# EAGLE design plunger-smt (EAGLE 5.06)
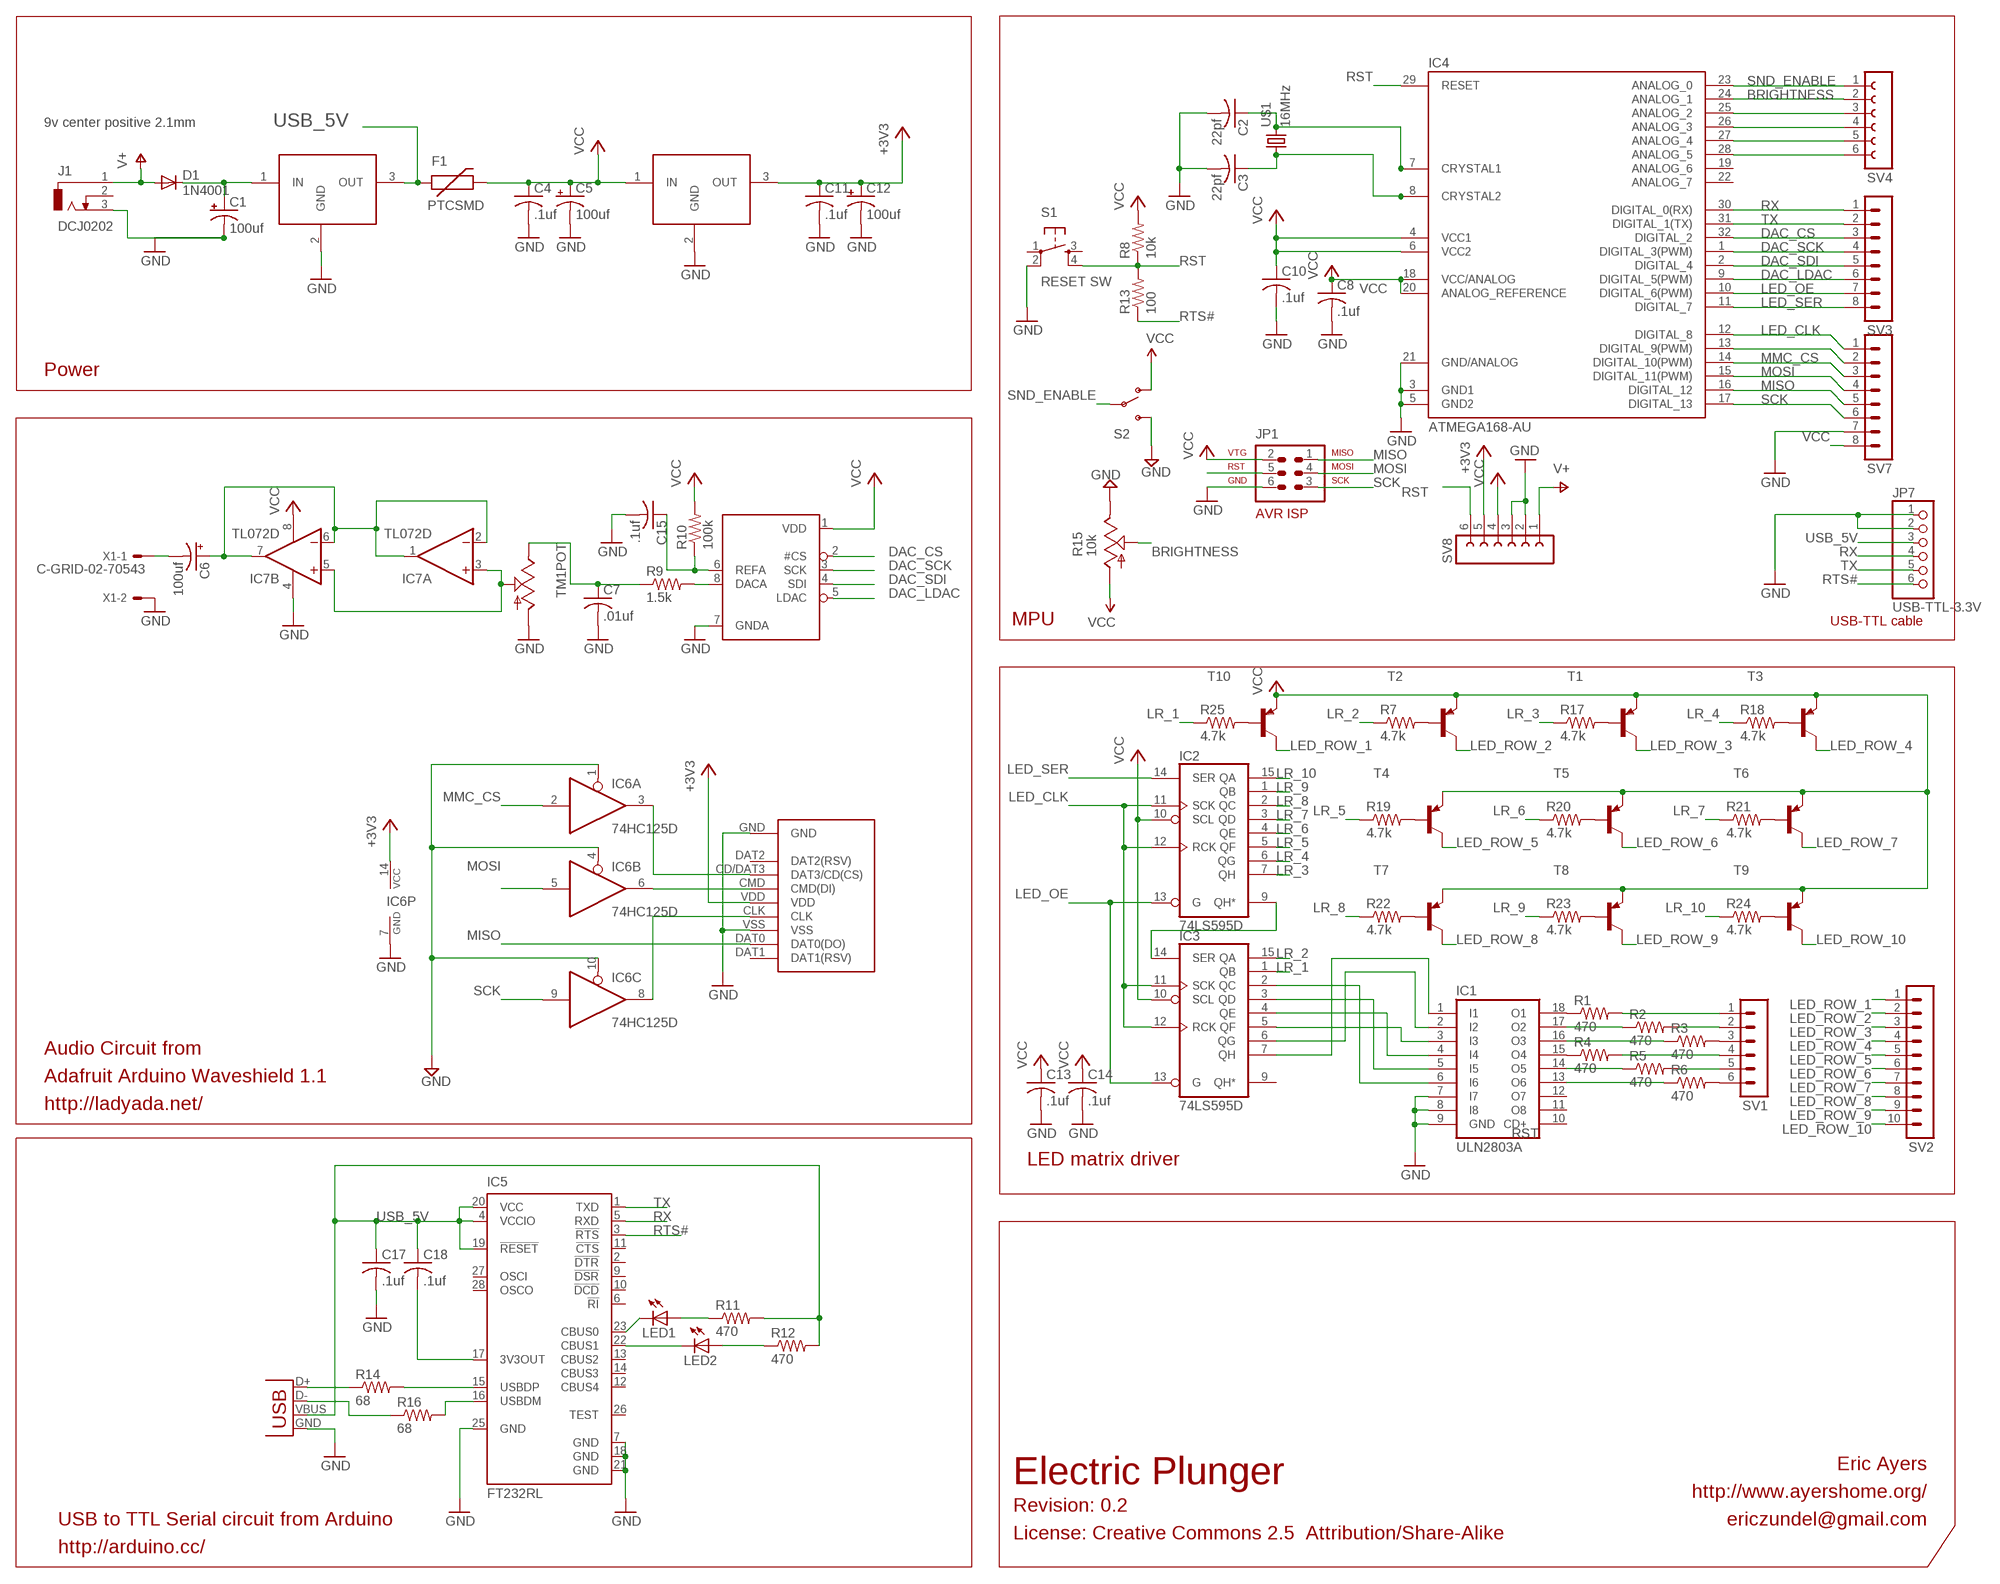
[diagram p0: schematic, sheet 1]

## Parts
C1  100uf  CPOL-USE  [PANASONIC_E]
C2  22pf  C-USC0805  [C0805]
C3  22pf  C-USC0805  [C0805]
C4  .1uf  C-USC0805  [C0805]
C5  100uf  CPOL-USE  [PANASONIC_E]
C6  100uf  CPOL-USD  [PANASONIC_D]
C7  .01uf  C-USC0805  [C0805]
C8  .1uf  C-USC0805  [C0805]
C10  .1uf  C-USC0805  [C0805]
C11  .1uf  C-USC0805  [C0805]
C12  100uf  CPOL-USE  [PANASONIC_E]
C13  .1uf  C-USC0805  [C0805]
C14  .1uf  C-USC0805  [C0805]
C15  .1uf  C-USC0805  [C0805]
C17  .1uf  C-USC0805  [C0805]
C18  .1uf  C-USC0805  [C0805]
D1  1N4001  DIODEPTH  [DIODE-1N4001]
F1  PTCSMD  [PTC-1206]
IC1  ULN2803A  ULN2803AULN2803ADW  [SO18W]
IC2  74LS595D  [SO16]
IC3  74LS595D  [SO16]
IC4  ATMEGA168-AU  [TQFP32-08]
IC5  FT232RL  [SSOP28]
IC6  74HC125D  [SO14]
IC7  TL072D  [SO08]
J1  DCJ0202  [DCJ0202]
JP1  AVR-ISP-6  [AVR-ISP-6]
JP7  USB-TTL-3.3V  PINHD-1X6CLEAN  [1X06-CLEAN]
LED1  LEDCHIPLED_0805  [CHIPLED_0805]
LED2  LEDCHIPLED_0805  [CHIPLED_0805]
R1  470  R-US_R0805  [R0805]
R2  470  R-US_R0805  [R0805]
R3  470  R-US_R0805  [R0805]
R4  470  R-US_R0805  [R0805]
R5  470  R-US_R0805  [R0805]
R6  470  R-US_R0805  [R0805]
R7  4.7k  R-US_R0805  [R0805]
R8  10k  R-US_R0805  [R0805]
R9  1.5k  R-US_R0805  [R0805]
R10  100k  R-US_R0805  [R0805]
R11  470  R-US_R0805  [R0805]
R12  470  R-US_R0805  [R0805]
R13  100  R-US_R0805  [R0805]
R14  68  R-US_R0805  [R0805]
R15  10k  TRIM_US-S63S  [S63S]
R16  68  R-US_R0805  [R0805]
R17  4.7k  R-US_R0805  [R0805]
R18  4.7k  R-US_R0805  [R0805]
R19  4.7k  R-US_R0805  [R0805]
R20  4.7k  R-US_R0805  [R0805]
R21  4.7k  R-US_R0805  [R0805]
R22  4.7k  R-US_R0805  [R0805]
R23  4.7k  R-US_R0805  [R0805]
R24  4.7k  R-US_R0805  [R0805]
R25  4.7k  R-US_R0805  [R0805]
REG3.3  KFBDT  [DPACK]
REG5.5  KFBDT  [DPACK]
S1  RESET SW  TAC_SWITCHPTH  [TACTILE-PTH]
S2  SWITCH-SPSTPTH  [SWITCH-SPDT]
SV1  MA06-1  [MA06-1]
SV2  MA10-1  [MA10-1]
SV3  MA08-1  [MA08-1]
SV4  FE06-1  [FE06]
SV7  MA08-1  [MA08-1]
SV8  FE06-1  [FE06]
T1  BC807-16-PNP-SOT23-BEC  [SOT23-BEC]
T2  BC807-16-PNP-SOT23-BEC  [SOT23-BEC]
T3  BC807-16-PNP-SOT23-BEC  [SOT23-BEC]
T4  BC807-16-PNP-SOT23-BEC  [SOT23-BEC]
T5  BC807-16-PNP-SOT23-BEC  [SOT23-BEC]
T6  BC807-16-PNP-SOT23-BEC  [SOT23-BEC]
T7  BC807-16-PNP-SOT23-BEC  [SOT23-BEC]
T8  BC807-16-PNP-SOT23-BEC  [SOT23-BEC]
T9  BC807-16-PNP-SOT23-BEC  [SOT23-BEC]
T10  BC807-16-PNP-SOT23-BEC  [SOT23-BEC]
TM1  THUMBPOT  [THUMBWHEEL]
U$1  16MHz  CRYTALTC26H  [TC26H]
U$2  MCP4921  [SO8]
U$3  HIROSE-MICRO-SD-DM3C-SF  [HIROSE-SD-MICRO]
X1  C-GRID-02-70543  [70543-02]
X2  USBPTH  [USB-B-PTH]

## Nets
+3V3: C11.1 C12.+ IC6.14(P:VCC) REG3.3.3(OUT) SV8.5 U$3.VDD
BRIGHTNESS: IC4.24(ANALOG_1) R15.S SV4.2
DAC_CS: IC4.32(DIGITAL_2) SV3.3 U$2.2(#CS)
DAC_LDAC: IC4.9(DIGITAL_5(PWM)) SV3.6 U$2.5(LDAC)
DAC_SCK: IC4.1(DIGITAL_3(PWM)) SV3.4 U$2.3(SCK)
DAC_SDI: IC4.2(DIGITAL_4) SV3.5 U$2.4(SDI)
GND: C1.- C2.2 C3.2 C4.2 C5.- C7.2 C8.2 C10.2 C11.2 C12.- C13.2 C14.2 C15.2 C17.2 IC1.7(I7) IC1.8(I8) IC1.9(GND) IC4.3(GND1) IC4.5(GND2) IC4.21(GND/ANALOG) IC5.7(GND) IC5.18(GND) IC5.21(GND) IC5.25(GND) IC6.1(A:OE) IC6.4(B:OE) IC6.7(P:GND) IC6.10(C:OE) IC7.4(P:V-) J1.3 JP1.6 JP7.1 JP7.2 R15.E REG3.3.2(GND) REG5.5.2(GND) S1.2 S2.3(S) SV7.7 SV8.2 SV8.3 TM1.1(POT:A) U$2.7(GNDA) U$3.GND U$3.VSS X1.2 X2.GND
LED_CLK: IC2.11(SCK) IC2.12(RCK) IC3.11(SCK) IC3.12(RCK) IC4.12(DIGITAL_8) SV7.1
LED_COL_1: R1.2 SV1.1
LED_COL_3: R3.2 SV1.3
LED_COL_4: R4.2 SV1.4
LED_COL_5: R5.2 SV1.5
LED_COL_6: R6.2 SV1.6
LED_OE: IC2.13(G) IC3.13(G) IC4.10(DIGITAL_6(PWM)) SV3.7
LED_ROW_1: SV2.1 T10.C
LED_ROW_2: SV2.2 T2.C
LED_ROW_3: SV2.3 T1.C
LED_ROW_4: SV2.4 T3.C
LED_ROW_5: SV2.5 T4.C
LED_ROW_6: SV2.6 T5.C
LED_ROW_7: SV2.7 T6.C
LED_ROW_8: SV2.8 T7.C
LED_ROW_9: SV2.9 T8.C
LED_ROW_10: SV2.10 T9.C
LED_SER: IC2.14(SER) IC4.11(DIGITAL_7) SV3.8
LR_1: IC3.1(QB) R25.1
LR_2: IC3.15(QA) R7.1
LR_3: IC2.7(QH) R17.1
LR_4: IC2.6(QG) R18.1
LR_5: IC2.5(QF) R19.1
LR_6: IC2.4(QE) R20.1
LR_7: IC2.3(QD) R21.1
LR_8: IC2.2(QC) R22.1
LR_9: IC2.1(QB) R23.1
LR_10: IC2.15(QA) R24.1
MISO: IC4.16(DIGITAL_12) JP1.1 SV7.5 U$3.DAT0(DAT0(DO))
MMC_CS: IC4.14(DIGITAL_10(PWM)) IC6.2(A:I) SV7.3
MOSI: IC4.15(DIGITAL_11(PWM)) IC6.5(B:I) JP1.4 SV7.4
N$2: IC1.6(I6) IC3.2(QC)
N$3: IC1.5(I5) IC3.3(QD)
N$4: IC1.4(I4) IC3.4(QE)
N$5: IC1.3(I3) IC3.5(QF)
N$6: IC1.2(I2) IC3.6(QG)
N$8: R2.2 SV1.2
N$10: IC1.13(O6) R6.1
N$11: IC1.18(O1) R1.1
N$12: IC1.16(O3) R3.1
N$13: IC1.14(O5) R5.1
N$14: IC1.1(I1) IC3.7(QH)
N$18: IC1.15(O4) R4.1
N$20: IC1.17(O2) R2.1
N$21: R7.2 T2.B
N$23: IC2.9(QH*) IC3.14(SER)
N$24: C2.1 IC4.7(CRYSTAL1) U$1.2
N$25: C3.1 IC4.8(CRYSTAL2) U$1.1
N$26: IC4.13(DIGITAL_9(PWM)) SV7.2
N$28: C15.1 R10.1 U$2.6(REFA)
N$29: IC5.16(USBDM) R16.2
N$30: R17.2 T1.B
N$34: C1.+ D1.C REG5.5.1(IN)
N$35: IC6.6(B:O) U$3.CMD(CMD(DI))
N$36: IC6.3(A:O) U$3.CD/DAT3(DAT3/CD(CS))
N$37: C6.+ IC7.1(A:OUT) IC7.2(A:-IN) IC7.6(B:-IN) IC7.7(B:OUT)
N$38: IC7.3(A:+IN) IC7.5(B:+IN) TM1.2(POT:S)
N$39: C6.- X1.1
N$40: IC4.25(ANALOG_2) SV4.3
N$41: IC6.8(C:O) U$3.CLK
N$42: C7.1 R9.1 TM1.3(POT:E)
N$43: IC4.26(ANALOG_3) SV4.4
N$44: IC4.27(ANALOG_4) SV4.5
N$45: R14.1 X2.D+
N$46: IC4.28(ANALOG_5) SV4.6
N$47: R18.2 T3.B
N$48: R19.2 T4.B
N$49: IC5.15(USBDP) R14.2
N$50: C18.2 IC5.17(3V3OUT)
N$51: IC5.23(CBUS0) LED1.C
N$52: IC5.22(CBUS1) LED2.C
N$53: LED1.A R11.1
N$54: LED2.A R12.1
N$55: R16.1 X2.D-
N$56: R9.2 U$2.8(DACA)
N$57: R20.2 T5.B
N$58: R21.2 T6.B
N$59: R22.2 T7.B
N$60: R23.2 T8.B
N$61: R24.2 T9.B
N$62: R25.2 T10.B
RST: IC4.29(RESET) JP1.5 R8.1 R13.2 S1.4 SV8.6
RTS#: IC5.3(!RTS) JP7.6 R13.1
RX: IC4.30(DIGITAL_0(RX)) IC5.5(RXD) JP7.4 SV3.1
SCK: IC4.17(DIGITAL_13) IC6.9(C:I) JP1.3 SV7.6
SND_ENABLE: IC4.23(ANALOG_0) S2.2(P) SV4.1
TX: IC4.31(DIGITAL_1(TX)) IC5.1(TXD) JP7.5 SV3.2
USB_5V: C17.1 C18.1 F1.1 IC5.4(VCCIO) IC5.19(!RESET) IC5.20(VCC) JP7.3 R11.2 R12.2 REG5.5.3(OUT) X2.VBUS
V+: D1.A J1.1 SV8.1
VCC: C4.1 C5.+ C8.1 C10.1 C13.1 C14.1 F1.2 IC2.10(SCL) IC3.10(SCL) IC4.4(VCC1) IC4.6(VCC2) IC4.18(VCC/ANALOG) IC4.20(ANALOG_REFERENCE) IC7.8(P:V+) JP1.2 R8.2 R10.2 R15.A REG3.3.1(IN) S2.1(O) SV7.8 SV8.4 T1.E T2.E T3.E T4.E T5.E T6.E T7.E T8.E T9.E T10.E U$2.1(VDD)
Unconnected: IC1.10(CD+) IC1.11(O8) IC1.12(O7) IC3.9(QH*) IC4.19(ANALOG_6) IC4.22(ANALOG_7) IC5.2(!DTR) IC5.6(!RI) IC5.9(!DSR) IC5.10(!DCD) IC5.11(!CTS) IC5.12(CBUS4) IC5.13(CBUS2) IC5.14(CBUS3) IC5.26(TEST) IC5.27(OSCI) IC5.28(OSCO) IC6.11(D:O) IC6.12(D:I) IC6.13(D:OE) J1.2 S1.1 S1.3 TM1.SW1(SW:S) TM1.SW2(SW:P) U$3.DAT1(DAT1(RSV)) U$3.DAT2(DAT2(RSV))

## Notes on the sheet
- 9v center positive 2.1mm
- Power
- MPU | USB-TTL cable
- Audio Circuit from
- Adafruit Arduino Waveshield 1.1
- http://ladyada.net/
- LED matrix driver
- Eric Ayers
- Electric Plunger
- http://www.ayershome.org/
- Revision: 0.2
- USB to TTL Serial circuit from Arduino | ericzundel@gmail.com
- License: Creative Commons 2.5  Attribution/Share-Alike
- http://arduino.cc/

## Power pins joined to a net without a drawn wire
GND: IC2.8(GND) IC3.8(GND)
VCC: IC2.16(VCC) IC3.16(VCC)

## Library data of the parts
C1 C5 C6 C12 = resistor:CPOL-US: POLARIZED CAPACITOR, American symbol
C2 C3 C7 C8 C10 C13-C15 C17 C18 = rcl:C-US: CAPACITOR, American symbol
C4 C11 = resistor:C-US: CAPACITOR, American symbol
D1 = SparkFun:DIODE: Diode These are standard reverse protection diodes and small signal diodes. SMA package can handle up to about 1A. SOD-323 can handle about 200mA. What the SOD-323 package when ordering, there are some mfgs out there that are 5-pin packages.
F1 = SparkFun:PTC: Resettable Fuse PTC Resettable Fuse. Spark Fun Electronics SKU : COM-08357
IC1 = uln-udn:ULN2803A: DRIVER ARRAY
IC2 IC3 = 74xx-us:74*595: 8-bit SHIFT REGISTER, output latch
IC4 = Arduino-AVR:ATMEGA168
IC5 = ftdichip:FT232R: Source: http://www.ftdichip.com/Documents/DataSheets/DS_FT232R_v104.pdf
IC6 = 74xx-eu:74*125: Quad bus BUFFER, 3-state
IC7 = linear:TL072: OP AMP
J1 = con-jack:DCJ0202: DC POWER JACK Source: DCJ0202.pdf
JP1 = avr-5-4.16:AVR-ISP-6: AVR ISP-6 Serial Programming Header
JP7 = carduino:PINHD-1X6: PIN HEADER
LED1 LED2 = led:LED: LED OSRAM: - CHIPLED LG R971, LG N971, LY N971, LG Q971, LY Q971, LO R971, LY R971 LH N974, LH R974 LS Q976, LO Q976, LY Q976 LO Q996 - Hyper CHIPLED LW Q18S LB Q993, LB Q99A, LB R99A - SideLED LS A670, LO A670, LY A670, LG A670, LP A670 LB A673, LV A673, LT A673, LW A673 LH A674 LY A675 LS A676, LA A676, LO A676, LY A676, LW A676 LS A679, LY A679, LG A679 - Hyper Micro SIDELED® LS Y876, LA Y876, LO Y876, LY Y876 LT Y87S - SmartLED LW L88C, LW L88S LB L89C, LB L89S, LG L890 LS L89K, LO L89K, LY L89K LS L896, LA L896, LO L896, LY L896 - TOPLED LS T670, LO T670, LY T670, LG T670, LP T670 LSG T670, LSP T670, LSY T670, LOP T670, LYG T670 LG T671, LOG T671, LSG T671 LB T673, LV T673, LT T673, LW T673 LH T674 LS T676, LA T676, LO T676, LY T676, LB T676, LH T676, LSB T676, LW T676 LB T67C, LV T67C, LT T67C, LS T67K, LO T67K, LY T67K, LW E67C LS E67B, LA E67B, LO E67B, LY E67B, LB E67C, LV E67C, LT E67C LW T67C LS T679, LY T679, LG T679 LS T770, LO T770, LY T770, LG T770, LP T770 LB T773, LV T773, LT T773, LW T773 LH T774 LS E675, LA E675, LY E675, LS T675 LS T776, LA T776, LO T776, LY T776, LB T776 LHGB T686 LT T68C, LB T68C - Hyper Mini TOPLED® LB M676 - Mini TOPLED Santana® LG M470 LS M47K, LO M47K, LY M47K Source: http://www.osram.convergy.de LUXEON: - LUMILED® LXK2-PW12-R00, LXK2-PW12-S00, LXK2-PW14-U00, LXK2-PW14-V00 LXK2-PM12-R00, LXK2-PM12-S00, LXK2-PM14-U00 LXK2-PE12-Q00, LXK2-PE12-R00, LXK2-PE12-S00, LXK2-PE14-T00, LXK2-PE14-U00 LXK2-PB12-K00, LXK2-PB12-L00, LXK2-PB12-M00, LXK2-PB14-N00, LXK2-PB14-P00, LXK2-PB14-Q00 LXK2-PR12-L00, LXK2-PR12-M00, LXK2-PR14-Q00, LXK2-PR14-R00 LXK2-PD12-Q00, LXK2-PD12-R00, LXK2-PD12-S00 LXK2-PH12-R00, LXK2-PH12-S00 LXK2-PL12-P00, LXK2-PL12-Q00, LXK2-PL12-R00 Source: www.luxeon.com KINGBRIGHT: KA-3528ASYC Source: www.kingbright.com
R1-R7 R11 R12 R14 R16-R25 = resistor:R-US_: RESISTOR, American symbol
R8-R10 R13 = rcl:R-US_: RESISTOR, American symbol
R15 = pot:TRIM_US-: POTENTIOMETER
REG3.3 REG5.5 = eza-custom:KF*BDT: LDO Voltage Regulator
S1 = SparkFun:TAC_SWITCH: Momentary Switch Button commonly used for reset or general input. Spark Fun Electronics SKU : COM-00097
S2 = SparkFun:SWITCH-SPST: SPST Switch Simple slide switch. Spark Fun Electronics SKU : COM-00102
SV1 = con-lstb:MA06-1: PIN HEADER
SV2 = con-lstb:MA10-1: PIN HEADER
SV3 SV7 = con-lstb:MA08-1: PIN HEADER
SV4 SV8 = con-lsta:FE06-1: FEMALE HEADER
T1-T10 = transistor:*-PNP-: PNP Transistror
TM1 = ashield:THUMBPOT
U$1 = crystal:CRYTAL: CRYSTAL
U$2 = eza-custom:MCP4921
U$3 = eza-custom:HIROSE-MICRO-SD-DM3C-SF: Hirose micro sd push-pull surface mount, solder tab. dm3c-sf from mouser $2.02
X1 = con-molex:C-GRID-02: CONNECTOR wire to board 2.54 mm (0.100") pitch header
X2 = SparkFun:USB: USB Connectors USB-B-PTH is fully proven SKU : PRT-00139 USB-miniB is fully proven SKU : PRT-00587 USB-A-PCB is untested. USB-A-H is throughly reviewed, but untested. Spark Fun Electronics SKU : PRT-00437 USB-B-SMT is throughly reviewed, but untested. Needs silkscreen touching up. USB-A-S has not been used/tested USB-MB-H has not been used/tested

## Net classes
2 gnd: width 0.305 mm, drill 0.508 mm, clearance 0.152 mm
3 usbvcc: width 0.508 mm, drill 0.508 mm, clearance 0.152 mm

## Board
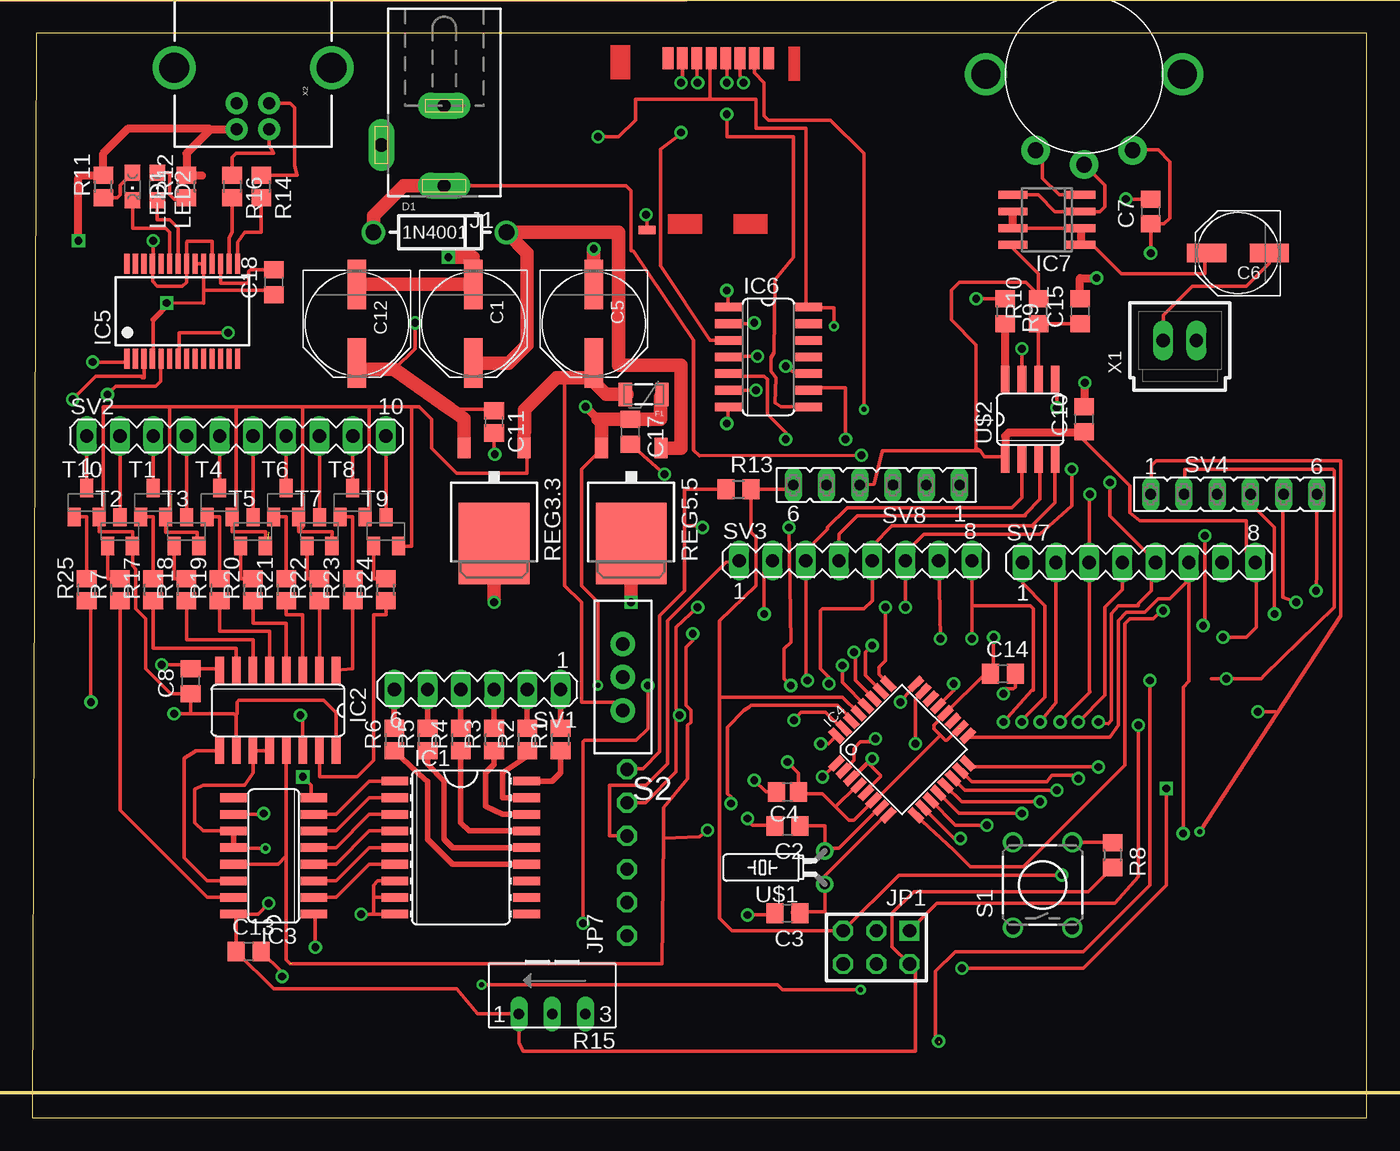
[diagram p1: board, top side]
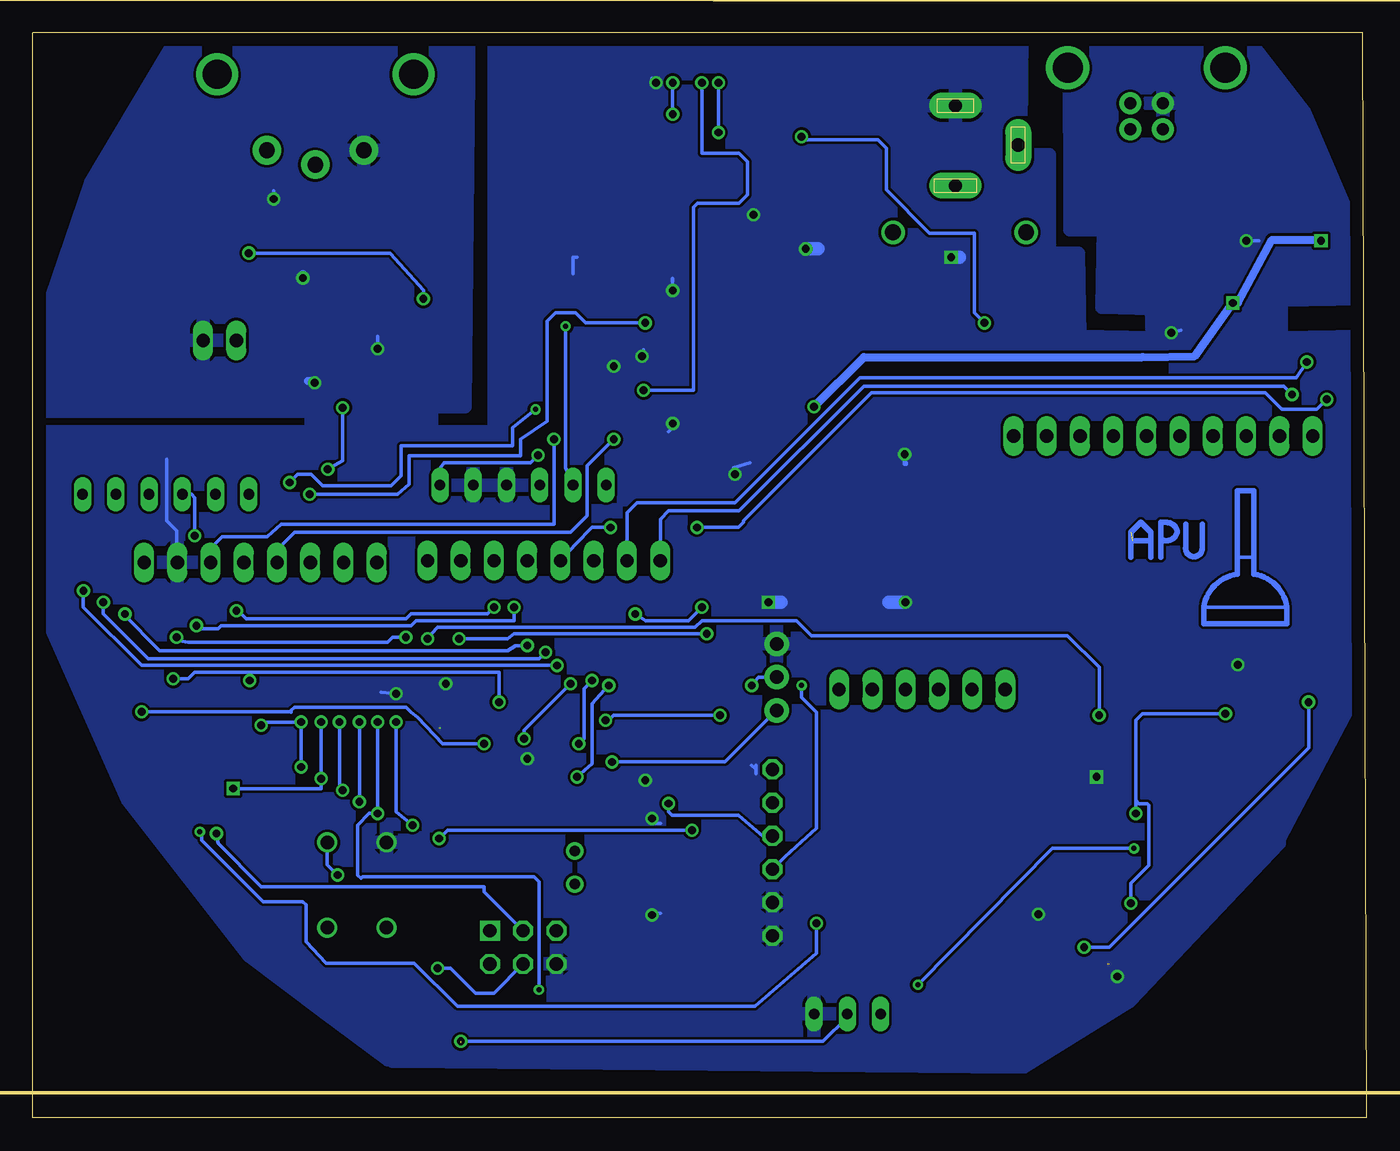
[diagram p2: board, bottom side, seen from below]

Size 101.92 x 82.87 mm. Coordinates in mm from the lower left corner, seen from the top.
Outline: 101.91,82.86 101.91,0 0,0 0.32,82.87 101.92,82.87
Copper layers (1*16): Top 0.035mm / dielectric 1.5mm / Bottom 0.035mm
Design rules "default *": minimum track width 10mil, minimum drill 15mil, track to track 8mil, track to pad 8mil, pad to pad 8mil, via to via 8mil, smd to smd 8mil, copper to edge 40mil, drill to drill 8mil, minimum pad ring 10mil, minimum via ring 8mil, stop-mask expansion 4mil, vias tented up to drill 0mil, thermal gap 10mil
Milling: 4 lines

### Footprints (pad centres in the part's own frame; a part is rotated, then mirrored left to right if it is on the bottom)
PANASONIC_E = smd 3.8 x 1.4: + 3,0; - -3,0
C0805 = smd 1.3 x 1.5: 1 -0.95,0; 2 0.95,0
C0805' = smd 1.3 x 1.5: 1 -0.85,0; 2 0.85,0
PANASONIC_D = smd 3 x 1.4: + 2.4,0; - -2.4,0
DIODE-1N4001 = drill 1.2 round: A -5.08,0; C 5.08,0
PTC-1206 = smd 1 x 1.8: 1 -1.4,0; 2 1.4,0
SO18W = smd 0.66 x 2.032: 1 -5.08,-5.029; 2 -3.81,-5.029; 3 -2.54,-5.029; 4 -1.27,-5.029; 5 0,-5.029; 6 1.27,-5.029; 7 2.54,-5.029; 8 3.81,-5.029; 9 5.08,-5.029; 10 5.08,5.029; 11 3.81,5.029; 12 2.54,5.029; 13 1.27,5.029; 14 0,5.029; 15 -1.27,5.029; 16 -2.54,5.029; 17 -3.81,5.029; 18 -5.08,5.029
SO16 = smd 0.66 x 2.032: 1 -4.445,-3.073; 2 -3.175,-3.073; 3 -1.905,-3.073; 4 -0.635,-3.073; 5 0.635,-3.073; 6 1.905,-3.073; 7 3.175,-3.073; 8 4.445,-3.073; 9 4.445,3.073; 10 3.175,3.073; 11 1.905,3.073; 12 0.635,3.073; 13 -0.635,3.073; 14 -1.905,3.073; 15 -3.175,3.073; 16 -4.445,3.073
TQFP32-08 = smd 1.27 x 0.559: 1 -4.293,2.8; 2 -4.293,2; 3 -4.293,1.2; 4 -4.293,0.4; 5 -4.293,-0.4; 6 -4.293,-1.2; 7 -4.293,-2; 8 -4.293,-2.8; 17 4.293,-2.8; 18 4.293,-2; 19 4.293,-1.2; 20 4.293,-0.4; 21 4.293,0.4; 22 4.293,1.2; 23 4.293,2; 24 4.293,2.8 | smd 0.559 x 1.27: 9 -2.8,-4.293; 10 -2,-4.293; 11 -1.2,-4.293; 12 -0.4,-4.293; 13 0.4,-4.293; 14 1.2,-4.293; 15 2,-4.293; 16 2.8,-4.293; 25 2.8,4.293; 26 2,4.293; 27 1.2,4.293; 28 0.4,4.293; 29 -0.4,4.293; 30 -1.2,4.293; 31 -2,4.293; 32 -2.8,4.293
SSOP28 = smd 0.4 x 1.5: 1 -4.225,-3.625; 2 -3.575,-3.625; 3 -2.925,-3.625; 4 -2.275,-3.625; 5 -1.625,-3.625; 6 -0.975,-3.625; 7 -0.325,-3.625; 8 0.325,-3.625; 9 0.975,-3.625; 10 1.625,-3.625; 11 2.275,-3.625; 12 2.925,-3.625; 13 3.575,-3.625; 14 4.225,-3.625; 15 4.225,3.625; 16 3.575,3.625; 17 2.925,3.625; 18 2.275,3.625; 19 1.625,3.625; 20 0.975,3.625; 21 0.325,3.625; 22 -0.325,3.625; 23 -0.975,3.625; 24 -1.625,3.625; 25 -2.275,3.625; 26 -2.925,3.625; 27 -3.575,3.625; 28 -4.225,3.625
SO14 = smd 0.66 x 2.032: 1 -3.81,-3.073; 2 -2.54,-3.073; 3 -1.27,-3.073; 4 0,-3.073; 5 1.27,-3.073; 6 2.54,-3.073; 7 3.81,-3.073; 8 3.81,3.073; 9 2.54,3.073; 10 1.27,3.073; 11 0,3.073; 12 -1.27,3.073; 13 -2.54,3.073; 14 -3.81,3.073
SO08 = smd 0.6 x 2.2: 1 -1.905,-2.6; 2 -0.635,-2.6; 3 0.635,-2.6; 4 1.905,-2.6; 5 1.905,2.6; 6 0.635,2.6; 7 -0.635,2.6; 8 -1.905,2.6
DCJ0202 = drill 1 pad 2 long: 1 0,3.1; 2 4.8,0; 3 0,-3
AVR-ISP-6 = drill 1.016 square: 1 -2.54,-1.27 | drill 1.016 octagon: 2 -2.54,1.27; 3 0,-1.27; 4 0,1.27; 5 2.54,-1.27; 6 2.54,1.27
1X06-CLEAN = drill 1.016 octagon: 1 -6.35,0; 2 -3.81,0; 3 -1.27,0; 4 1.27,0; 5 3.81,0; 6 6.35,0
CHIPLED_0805 = smd 1.2 x 1.2: A 0,-1.05; C 0,1.05
R0805 = smd 1.3 x 1.5: 1 -0.85,0; 2 0.85,0
R0805' = smd 1.3 x 1.5: 1 -0.95,0; 2 0.95,0
S63S = drill 0.813 long: A 2.54,1.27; E -2.54,1.27; S 0,1.27
DPACK = smd 1 x 1.6: 1 -2.28,-4.8; 3 2.28,-4.8 | smd 5.4 x 6.2: 2 0,2.5
TACTILE-PTH = drill 1.016 round: 1 -3.251,2.261; 2 3.251,2.261; 3 -3.251,-2.261; 4 3.251,-2.261
SWITCH-SPDT = drill 1.016 pad 1.88 round: 1 0,2.54; 2 0,0; 3 0,-2.54
MA06-1 = drill 1.016 long: 1 -6.35,0; 2 -3.81,0; 3 -1.27,0; 4 1.27,0; 5 3.81,0; 6 6.35,0
MA10-1 = drill 1.016 long: 1 -11.43,0; 2 -8.89,0; 3 -6.35,0; 4 -3.81,0; 5 -1.27,0; 6 1.27,0; 7 3.81,0; 8 6.35,0; 9 8.89,0; 10 11.43,0
MA08-1 = drill 1.016 long: 1 -8.89,0; 2 -6.35,0; 3 -3.81,0; 4 -1.27,0; 5 1.27,0; 6 3.81,0; 7 6.35,0; 8 8.89,0
FE06 = drill 0.813 long: 1 -6.35,0; 2 -3.81,0; 3 -1.27,0; 4 1.27,0; 5 3.81,0; 6 6.35,0
SOT23-BEC = smd 1 x 1.4: B -0.95,-1.1; C 0,1.1; E 0.95,-1.1
THUMBWHEEL = drill 1.2 pad 2.184 round: 1 -3.7,-5.8; 2 0,-6.9; 3 3.7,-5.8 | drill 2.2 round: SW1 -7.5,0; SW2 7.5,0
TC26H = drill 0.813 round: 1 -1.27,0; 2 1.27,0
SO8 = smd 0.66 x 2.032: 1 -1.905,-3.073; 2 -0.635,-3.073; 3 0.635,-3.073; 4 1.905,-3.073; 5 1.905,3.073; 6 0.635,3.073; 7 -0.635,3.073; 8 -1.905,3.073
HIROSE-SD-MICRO = smd 0.813 x 1.676: CD/DAT3 -5.5,1; CLK -8.8,1; CMD -6.6,1; DAT0 -11,1; DAT1 -12.1,1; DAT2 -4.4,1; VDD -7.7,1; VSS -9.9,1 | smd 1.27 x 0.66: GND -2.8,14.1
70543-02 = drill 1.016 long: 1 -1.27,0; 2 1.27,0
USB-B-PTH = drill 0.914 pad 1.676 round: D+ 0,1.25; D- 1.981,1.25; GND 0,-1.25; VBUS 1.981,-1.25 | drill 2.286 round: P$1 -2.718,-6.02; P$2 -2.718,6.02

### Placement (x,y rotation side)
C1  33.66,60.64 270 top
C2  57.66,22.29 180 top
C3  57.66,15.62 180 top
C4  .1uf  [C0805']  57.66,24.89 180 top
C5  42.86,60.64 270 top
C6  92.08,66.04 180 top
C7  85.41,69.22 90 top
C8  12.06,33.34 90 top
C10  80.33,53.34 90 top
C11  .1uf  [C0805']  35.24,53.15 270 top
C12  24.77,60.64 270 top
C13  16.51,12.7 0 top
C14  74.1,33.91 0 top
C15  80.01,61.59 90 top
C17  45.66,52.39 270 top
C18  18.41,63.82 90 top
D1  31.11,67.63 0 top
F1  46.67,55.24 180 top
IC1  32.7,20.64 270 top
IC2  18.73,31.11 180 top
IC3  18.41,20 90 top
IC4  66.42,28.13 45 top
IC5  11.43,61.59 0 top
IC6  56.2,58.1 270 top
IC7  77.47,68.58 90 top
J1  31.43,74.3 180 top
JP1  64.45,13.02 180 top
JP7  45.4,20.26 90 top
LED1  7.62,71.12 180 top
LED2  9.53,71.12 180 top
R1  40.32,28.89 90 top
R2  37.78,28.89 90 top
R3  35.24,28.89 90 top
R4  32.7,28.89 90 top
R5  30.16,28.89 90 top
R6  27.62,28.89 90 top
R7  6.67,40.32 90 top
R8  10k  [R0805']  82.49,20.07 270 top
R9  1.5k  [R0805']  74.3,61.59 270 top
R10  100k  [R0805']  76.83,61.59 90 top
R11  5.4,71.12 90 top
R12  11.75,71.12 90 top
R13  100  [R0805']  53.91,48.01 0 top
R14  17.46,71.12 270 top
R15  39.69,9.21 180 top
R16  15.24,71.12 270 top
R17  9.21,40.32 90 top
R18  11.75,40.32 90 top
R19  14.29,40.32 90 top
R20  16.83,40.32 90 top
R21  19.37,40.32 90 top
R22  21.91,40.32 90 top
R23  24.45,40.32 90 top
R24  26.99,40.32 90 top
R25  4.13,40.32 90 top
REG3.3  35.24,46.35 180 top
REG5.5  45.72,46.35 180 top
S1  77.15,17.78 90 top
S2  45.09,33.66 180 top
SV1  33.97,32.7 180 top
SV2  15.56,52.07 0 top
SV3  62.87,42.55 0 top
SV4  91.76,47.62 0 top
SV7  84.52,42.42 0 top
SV8  64.45,48.32 180 top
T1  9.21,46.99 0 top
T2  6.67,44.77 0 top
T3  11.75,44.77 0 top
T4  14.29,46.99 0 top
T5  16.83,44.77 0 top
T6  19.37,46.99 0 top
T7  21.91,44.77 0 top
T8  24.45,46.99 0 top
T9  26.99,44.77 0 top
T10  4.13,46.99 0 top
TM1  80.33,79.69 0 top
U$1  60.52,19.11 90 top
U$2  76.2,53.34 0 top
U$3  44.13,81.92 180 top
X1  87.63,59.37 0 top
X2  16.83,77.47 270 top

### Tracks (layer width: path | path; a pad name or v marks a point on that pad's centre or on a via)
+3V3  (via drill 0.38, 0.6)
  Top 0.254: 51.75,77.79 46.04,77.79 46.04,76.2 44.77,74.93 v43.18,74.93 | 51.75,77.79 55.24,77.79 55.24,75.56 59.05,75.56 59.05,62.13 IC6.14 59.31,61.85 61.21,61.85 v61.21,60.45 | U$3.VDD 51.75,81.13 51.75,77.79 | 27.62,57.15 29.21,58.74 v29.21,60.71 | C11.1 35.24,54.12 31.93,54.12
  Top 1.016: REG3.3.3 32.96,53.4 31.93,54.12 27.62,57.15 24.94,57.15 C12.+
  Bottom 0.254: v61.21,60.45 61.21,49.66 SV8.5 | v29.21,60.71 29.97,61.47 29.97,67.56 33.4,67.56 36.7,70.87 36.7,74.04 37.34,74.68 42.93,74.68 v43.18,74.93
BRIGHTNESS  (via drill 0.6)  (1 unrouted)
  Top 0.254: 69.22,5.71 68.96,5.97 68.96,11.18 70.48,12.7 80.26,12.7 85.34,17.78 v85.34,33.4 | 91.06,33.53 90.04,33.53 | SV4.2 88.01,47.69 88.01,49.53 99.31,49.53 99.44,49.4 99.44,38.99 94.11,33.78 93.85,33.53 91.06,33.53 | v66.29,31.75 67.44,33.15 IC4.24 | v91.19,33.53 91.06,33.53
  Bottom 0.254: R15.S 39.69,7.68 41.53,5.84 v69.22,5.84 | v91.19,33.53 90.04,33.53 89.53,34.04 85.34,34.04 | 85.34,34.04 66.29,34.04 v66.29,31.75 | v85.34,33.4 85.34,34.04
DAC_CS  (via drill 0.6)
  Top 0.254: U$2.2 75.56,47.37 74.8,46.61 62.23,46.61 60.71,45.09 60.71,44.96 59.18,43.43 59.18,42.67 SV3.3 59.05,33.78 58.93,33.66 v59.18,33.4 | v60.2,28.57 60.8,28.57 IC4.32
  Bottom 0.254: v59.18,33.4 59.82,32.77 59.82,28.96 v60.2,28.57
DAC_LDAC  (via drill 0.6)
  Top 0.254: U$2.5 78.23,56.29 v78.23,54.23 | v79.38,49.53 79.38,46.74 76.96,44.58 68.07,44.58 66.67,43.18 SV3.6 v66.67,38.99 | v86.36,38.73 86.11,38.61 85.6,38.1 83.82,38.1 83.44,37.72 83.44,26.92 75.69,19.18 71.63,19.18 70.36,20.45 IC4.9
  Bottom 0.254: v78.23,54.23 78.23,50.16 v79.38,49.53 | v66.67,38.99 67.18,38.48 73.03,38.48 73.41,38.1 85.6,38.1 86.11,38.61 v86.36,38.73
DAC_SCK  (via drill 0.6)
  Top 0.254: U$2.3 76.96,50.14 76.96,47.24 75.82,46.1 75.82,45.97 62.99,45.97 61.59,44.58 SV3.4 | v57.78,45.09 57.91,36.32 57.4,35.81 57.4,33.53 v57.91,33.02 | v60.33,26.04 60.37,26.04 IC4.1
  Bottom 0.254: SV3.4 60.45,43.81 59.18,45.09 v57.78,45.09 | v57.91,33.02 59.18,31.62 59.18,27.05 v60.33,26.04
DAC_SDI  (via drill 0.6)
  Top 0.254: U$2.4 78.11,46.99 76.45,45.34 76.45,45.09 76.33,45.21 65.66,45.21 64.14,43.69 SV3.5 64.14,39.5 63.5,38.86 60.33,38.86 60.2,38.73 60.2,34.29 60.83,33.66 v60.83,33.15 | v64.39,28.96 64.14,28.7 63.25,28.7 62.74,28.19 62.74,27.3 61.97,26.54 IC4.2
  Bottom 0.254: v60.83,33.15 64.39,29.59 v64.39,28.96
GND  (via drill 0.6)
  Top 0.254: IC2.8 14.29,34.29 C8.2 11.74,34.61 v9.84,34.61 | v25.08,15.56 26.04,15.56 | 26.04,15.56 IC1.9 | IC1.7 26.35,18.1 26.04,17.78 26.04,16.83 | 26.04,15.56 26.04,16.83 | 26.04,16.83 IC1.8 | IC6.1 53.12,63.18 v53.02,63.18 | IC3.8 21.27,24.66 21.27,25.4 v20.64,26.04 | U$2.7 v75.56,58.74 | IC6.7 53.12,53.12 v53.02,53.02 | U$3.VSS 54.03,79.64 v54.29,79.06 | C13.2 19.05,11.11 v19.05,10.79 | IC7.4 78.42,70.48 77.15,71.75 77.15,73.37 TM1.1 | C7.2 v83.5,70.17 | v9.21,66.99 9.21,65.27 IC5.25 9.15,63.87 9.53,63.5 11.43,63.5 11.75,63.82 IC5.21 11.76,66.87 11.81,66.93 13.72,66.93 13.72,65.34 IC5.18 | IC5.7 11.18,57.96 11.18,59.94 v14.92,59.94 | IC6.10 59.21,56.9 58.17,56.9 v57.53,57.4 | IC6.4 53.19,58.17 v55.37,58.17 | C2.2 56.71,22.35 54.99,22.35 54.61,22.73 v54.61,22.86 | C3.2 56.71,15.49 v54.61,15.49 | C11.2 35.24,50.67 v35.31,50.67 | C17.2 v48.26,49.15 | C4.2 56.01,24.89 v55.12,25.78 | IC4.21 69.22,31.5 | 69.22,31.5 70.36,32.64 v70.36,33.15 | C14.2 75.06,32.89 74.93,32.77 74.17,32.77 v74.17,32.38 | IC4.5 63.67,24.93 64.77,26.04 64.77,26.16 63.88,27.05 63.64,27.05 IC4.3 62.65,25.94 v64.14,27.43 | 69.22,31.5 69.22,31.49 | 69.22,31.5 69.09,31.5 | U$3.GND 46.93,68.89 v46.86,68.96
  Top 0.61: C15.2 80.01,64.14 v81.28,64.14 | C10.2 80.39,54.35 v80.39,56.13
  Top 1.016: C12.- C1.- 33.66,65.72 v31.75,65.72 | v45.72,39.37 REG5.5.2 | v35.24,39.37 REG3.3.2 | C5.- v42.86,66.36
  Bottom 0.254: v25.08,15.56 24.77,15.56 | 60.64,64.45 60.64,65.72 60.33,65.72 | v53.02,63.18 53.02,64.14 | v20.64,26.04 20.95,26.04 | 46.67,26.61 46.99,26.92 | 46.67,26.61 46.67,26.92 | 46.67,26.29 46.67,26.61 | v75.56,58.74 75.56,59.69 | v53.02,53.02 53.02,52.7 53.34,52.39 | v54.29,79.06 54.61,79.38 | v19.05,10.79 19.05,11.11 | v83.5,70.17 83.5,70.8 | v9.21,66.99 8.26,66.99 | v14.92,59.94 14.22,60.13 | v57.53,57.4 57.4,57.53 57.53,57.28 | v55.37,58.17 55.24,58.29 55.24,58.67 | v54.61,22.86 54.61,22.48 53.98,22.48 | v54.61,15.49 54.61,15.62 53.98,15.62 | v35.31,50.67 35.31,50.04 | 35.31,50.04 35.31,49.91 35.18,49.91 35.18,50.04 35.31,50.04 | v48.26,49.15 48.39,49.66 47.12,50.04 | v55.12,25.78 54.86,26.04 | v70.36,33.15 70.48,32.89 70.74,33.15 | v74.17,32.38 75.31,32.51 | v64.14,27.43 64.14,27.69 64.26,27.69 64.26,27.81 64.39,27.69 64.39,27.43 64.26,27.43 | SV7.7 90.93,42.48 90.93,44.83 91.69,45.59 91.69,50.29 | v46.86,68.96 46.74,69.09
  Bottom 0.61: v81.28,64.14 81.28,64.45 | v80.39,56.13 80.52,56.26 80.9,56.26
  Bottom 1.016: v31.75,65.72 31.11,65.72 | 44.77,39.37 v45.72,39.37 | v35.24,39.37 36.51,39.37 | v42.86,66.36 41.91,66.36
  pour Bottom: 9.21,82.55 22.73,82.55 22.67,67.82 20.13,67.82 20.26,61.91 16.45,61.79 16.38,59.56 21.91,59.69 22.03,66.04 24.26,66.04 24.26,73.53 26.42,73.53 26.42,75.44 26.35,82.74 66.67,83.19 66.67,52.39 71.44,52.39 71.44,54.29 68.9,54.29 68.58,83.19 90.49,83.19 97.47,71.44 100.97,61.28 101.28,53.98 80.64,53.98 80.64,52.39 101.28,52.39 100.97,38.42 94.68,24.26 85.41,12.38 79.69,8.06 74.8,4.45 74.42,4.32 26.23,3.87 18.1,8.89 6.67,20.95 6.67,21.27 0.64,32.7 0.32,45.09 0.32,59.69 6.54,59.56 6.54,62.42 0.32,62.55 0.32,66.36 4.76,76.83
LED_CLK  (via drill 0.38, 0.6)
  Top 0.254: IC2.12 IC2.11 16.83,26.35 16.19,25.4 13.02,25.4 12.38,25.08 12.38,22.54 13.02,21.91 IC3.11 | v34.29,10.16 56.9,10.16 57.28,9.78 v63.25,9.78 | v17.78,20.57 15.24,20.57 IC3.12 | SV7.1 75.63,40.83 77.34,39.12 77.34,32.13 75.56,30.35 v75.56,30.23 | v75.56,23.24 70.74,23.24 IC4.12
  Top 0.406: IC3.11 IC3.12
  Bottom 0.254: v34.29,10.16 24,20.57 v17.78,20.57 | v75.56,23.24 v75.56,30.23 | v63.25,9.78 63.25,18.03 63.63,18.41 76.71,18.41 76.83,18.29 77.09,18.54 77.09,22.35 76.2,23.24 v75.56,23.24 | v75.56,23.24 75.31,23.24
LED_COL_1
  Top 0.406: R1.2 SV1.1
LED_COL_3
  Top 0.406: R3.2 SV1.3
LED_COL_4
  Top 0.406: R4.2 SV1.4
LED_COL_5
  Top 0.406: R5.2 SV1.5
LED_COL_6
  Top 0.406: R6.2 SV1.6
LED_OE  (via drill 0.6)  (1 unrouted)
  Top 0.254: IC3.13 18.73,19.37 19.37,20 | 19.37,20 IC2.13 | 19.37,20 19.37,12.06 19.68,11.75 | v50.42,36.96 50.42,36.45 49.91,35.94 49.91,31.5 50.29,31.11 50.29,30.23 50.04,29.97 50.04,25.91 48.2,23.69 48.17,21.34 | v69.34,36.58 SV3.7 | 48.17,21.34 48.07,11.75 19.81,11.75 | IC4.10 70.39,21.34 v70.87,21.34 | v51.56,21.97 50.93,21.46 48.17,21.34
  Bottom 0.254: v69.34,36.58 65.66,36.58 65.15,36.96 v50.42,36.96 | v70.87,21.34 70.23,21.97 v51.56,21.97
LED_ROW_1
  Top 0.254: T10.C SV2.1
LED_ROW_2
  Top 0.254: T2.C SV2.2
LED_ROW_3
  Top 0.254: T1.C SV2.3
LED_ROW_4
  Top 0.254: T3.C SV2.4
LED_ROW_5
  Top 0.254: T4.C SV2.5
LED_ROW_6
  Top 0.254: T5.C SV2.6
LED_ROW_7
  Top 0.254: T6.C SV2.7
LED_ROW_8
  Top 0.254: T7.C SV2.8
LED_ROW_9
  Top 0.254: T8.C SV2.9
LED_ROW_10
  Top 0.254: T9.C SV2.10
LED_SER  (via drill 0.6)
  Top 0.254: IC2.14 20.64,30.54 v20.45,30.73 | v71.75,36.58 71.75,39.12 | 71.75,39.12 SV3.8 | IC4.11 70.5,22.35 v72.9,22.35 | v74.17,30.23 76.33,32.64 76.45,32.64 76.45,38.86 76.2,39.12 71.75,39.12
  Bottom 0.254: v20.45,30.73 20.45,34.42 22.86,36.83 42.42,36.83 43.56,37.97 50.8,37.97 51.31,37.47 70.99,37.47 71.12,37.34 v71.75,36.58 | v72.9,22.35 74.17,23.37 v74.17,30.23
LR_1  (via drill 0.6)
  Top 0.254: R25.1 3.81,39.47 4.45,38.84 v4.45,31.75 | v21.59,13.02 21.59,15.46 IC3.1
  Bottom 0.254: v4.45,31.75 4.45,28.26 19.68,13.02 v21.59,13.02
LR_2
  Top 0.254: 6.99,39.47 R7.1 6.67,23.5 13.34,16.83 IC3.15
LR_3
  Top 0.254: R17.1 9.21,35.88 15.56,35.88 IC2.7
LR_4
  Top 0.254: R18.1 11.75,36.51 16.83,36.51 IC2.6
LR_5
  Top 0.254: R19.1 14.29,37.15 18.1,37.15 IC2.5
LR_6
  Top 0.254: R20.1 16.83,37.78 19.37,37.78 IC2.4
LR_7
  Top 0.254: R21.1 19.37,38.42 20.64,38.42 IC2.3
LR_8
  Top 0.254: IC2.2 R22.1
LR_9
  Top 0.254: R23.1 24.45,34.29 IC2.1
LR_10
  Top 0.254: R24.1 26.99,38.42 26.04,38.42 26.04,27.3 24.77,26.04 21.91,26.04 IC2.15
MISO  (via drill 0.38, 0.6)
  Top 0.254: U$3.DAT0 55.13,79.81 55.88,79.06 55.88,76.52 56.2,76.2 60.96,76.2 63.5,73.66 v63.5,54.1 | v82.3,48.51 82.3,45.97 85.09,43.18 SV7.5 85.47,42.1 85.47,40.26 84.45,39.24 84.45,39.12 82.93,39.12 82.42,38.48 82.42,30.35 82.17,30.1 v81.41,30.23 | v81.41,26.8 71.71,26.8 IC4.16 | JP1.1 69.09,16.38 82.68,16.38 84.45,18.41 v84.45,29.97
  Bottom 0.254: v63.5,54.1 65.28,52.7 65.28,51.31 73.79,51.31 73.79,49.02 74.55,48.26 79.76,48.26 80.64,49.15 81.66,49.15 v82.3,48.51 | v81.41,26.8 v81.41,30.23 84.33,30.23 v84.45,29.97
MMC_CS  (via drill 0.6)
  Top 0.254: IC6.2 55.05,60.64 v55.12,60.71 | v80.77,47.62 80.71,47.31 SV7.3 80.71,32.7 80.77,32.51 v78.49,30.23 | v78.23,25.02 71.23,25.02 IC4.14
  Bottom 0.254: v55.12,60.71 59.69,60.71 60.45,61.47 61.98,61.47 62.61,60.83 62.61,53.21 64.64,51.82 64.64,50.55 73.15,50.55 73.15,48.39 74.04,47.62 v80.77,47.62 | v78.49,30.23 78.49,25.27 v78.23,25.02
MOSI  (via drill 0.6)
  Top 0.254: IC6.5 53.31,56.64 55.88,56.64 56.13,56.39 56.13,53.72 57.53,52.32 v57.53,51.82 | SV7.4 83.25,40.32 81.92,38.99 81.92,32.26 v79.88,30.23 | v79.88,25.91 79.76,25.91 79.5,26.16 77.85,26.16 77.47,25.65 71.75,25.65 71.25,26.16 71.22,26.16 IC4.15 | v70.99,11.43 80.26,11.43 86.61,17.78 v86.61,25.15
  Bottom 0.254: v57.53,51.82 59.56,49.78 59.56,45.97 60.83,44.7 81.92,44.7 83.25,43.37 SV7.4 | v79.88,30.23 v79.88,25.91 79.88,25.15 v86.61,25.15 | JP1.4 66.67,9.53 68.07,9.53 69.98,11.43 v70.99,11.43
N$2
  Top 0.254: IC3.2 23.18,16.83 25.72,19.37 IC1.6
N$3
  Top 0.254: IC3.3 23.18,18.1 25.72,20.64 IC1.5
N$4
  Top 0.254: IC3.4 23.18,19.37 25.72,21.91 IC1.4
N$5
  Top 0.254: IC3.5 23.18,20.64 25.72,23.18 IC1.3
N$6
  Top 0.254: IC3.6 23.18,21.91 25.72,24.45 IC1.2
N$8
  Top 0.406: R2.2 SV1.2
N$10
  Top 0.406: IC1.13 32.07,19.37 30.16,21.27 30.16,25.72 29.95,25.84 R6.1
N$11
  Top 0.406: R1.1 40.32,26.35 39.69,25.72 IC1.18
N$12
  Top 0.406: R3.1 35.24,26.99 34.61,26.35 34.61,23.81 35.88,23.18 IC1.16
N$13
  Top 0.406: R5.1 30.16,26.99 31.43,25.72 31.43,21.27 32.07,20.64 IC1.14
N$14
  Top 0.254: IC3.7 23.18,23.18 25.72,25.72 IC1.1
N$18
  Top 0.406: IC1.15 33.34,21.91 32.7,22.54 R4.1
N$20
  Top 0.406: R2.1 37.78,27.62 35.88,26.35 35.88,24.45 IC1.17
N$21
  Top 0.254: T2.B 5.72,41.17 R7.2
N$23
  Top 0.254: IC2.9 12.48,28.04 11.59,27.46 11.59,19.84 13.34,18.1 IC3.14
N$24
  Top 0.254: C2.1 60.52,22.29 U$1.2 60.71,20.57 61.59,20.57 64.7,23.68 IC4.7
N$25
  Top 0.254: C3.1 58.04,15.62 58.04,15.75 60.52,15.75 U$1.1 60.45,17.91 60.45,18.41 65.15,23.11 IC4.8
N$26  (via drill 0.6)
  Top 0.254: SV7.2 78.17,31.69 v76.96,30.23 | v76.96,24.13 70.99,24.13 IC4.13
  Bottom 0.254: v76.96,24.13 v76.96,30.23
N$28
  Top 0.254: C15.1 R10.1 U$2.6
N$29
  Top 0.254: R16.2 15.24,67.63 15.01,67.23 IC5.16
N$30
  Top 0.254: R17.2 9.21,45.89 T1.B
N$34
  Top 1.016: REG5.5.1 48.04,51.12 49.53,51.12 49.53,57.47 44.77,57.47 44.77,67.63 D1.C 37.78,66.04 37.78,59.05 36.37,57.64 C1.+
N$35  (via drill 0.6)
  Top 0.254: U$3.CMD 50.73,79.44 v50.8,79.06 | IC6.6 v55.24,55.56
  Bottom 0.254: v50.8,79.06 50.8,73.66 47.94,73.66 47.31,73.03 47.31,70.48 47.94,69.85 51.12,69.85 51.44,69.53 51.44,55.56 v55.24,55.56
N$36  (via drill 0.6)
  Top 0.254: IC6.3 51.75,59.37 47.94,65.09 47.94,73.98 49.63,75.25 49.53,74.83 v49.53,75.25 | U$3.CD/DAT3 49.63,79.48 v49.53,79.06
  Bottom 0.254: v49.53,75.25 v49.53,79.06
N$37
  Top 0.254: IC7.7 IC7.2 | IC7.1 80.96,66.67 83.19,64.45 89.53,64.45 89.53,65.9 C6.+
  Top 0.61: IC7.2 IC7.1 | IC7.7 IC7.6
N$38
  Top 0.254: IC7.5 76.83,70.48 78.11,69.22 IC7.3 81.53,69.22 81.92,69.6 81.92,71.2 TM1.2
N$39
  Top 0.254: C6.- 94.47,65.27 92.71,63.5 88.58,63.5 86.36,61.28 X1.1
N$40  (via drill 0.6)
  Top 0.254: IC4.25 64.64,33.87 64.64,34.42 65.15,34.92 v65.15,38.99 | v89.41,37.59 89.53,37.72 v89.53,44.45
  Bottom 0.254: v65.15,38.99 65.15,37.97 72.64,37.97 73.03,37.59 87.5,37.59 87.76,37.34 89.15,37.34 v89.41,37.59 | v89.53,44.45 89.53,47.37 89.79,47.62 SV4.3
N$41  (via drill 0.6)
  Top 0.254: v53.02,76.64 53.02,74.93 58.1,74.93 58.1,65.72 56.71,64.01 56.64,58.42 56.39,58.04 56.39,57.02 56.77,56.52 56.71,54.61 57.15,54.29 IC6.8 | v53.02,79.06 53.02,81.14 U$3.CLK
  Bottom 0.254: v53.02,76.64 v53.02,79.06
N$42  (via drill 0.6)
  Top 0.254: v85.41,66.04 C7.1 86.05,68.26 86.42,68.26 86.87,68.71 86.87,73.03 85.98,73.91 84.05,73.91 TM1.3 | v72.07,62.55 R9.1
  Bottom 0.254: v85.41,66.04 74.61,66.04 72.07,63.18 v72.07,62.55
N$43  (via drill 0.6)
  Top 0.254: IC4.26 64.8,32.61 63.63,33.78 63.63,35.56 v64.14,36.07 | v94.87,38.48 94.87,45.09 93.03,46.93 SV4.4
  Bottom 0.254: v64.14,36.07 65.02,36.07 65.66,35.69 92.2,35.69 95,38.48 v94.87,38.48
N$44  (via drill 0.6)
  Top 0.254: IC4.27 64.23,32.03 62.87,33.4 62.87,35.43 v62.74,35.56 | v96.52,39.37 95.5,39.75 95.5,47.18 SV4.5
  Bottom 0.254: v62.74,35.56 63.25,35.05 93.09,35.05 96.52,38.48 v96.52,39.37
N$45
  Top 0.254: X2.D+ 19.68,77.47 20,77.15 20,72.71 20.22,71.97 R14.1
N$46  (via drill 0.6)
  Top 0.254: SV4.6 98.11,41.85 v98.04,40.26 | v61.85,34.54 61.85,33.27 IC4.28
  Bottom 0.254: v61.85,34.54 93.6,34.54 98.04,38.99 v98.04,40.26
N$47
  Top 0.254: T3.B 10.8,41.17 R18.2
N$48
  Top 0.254: T4.B 14.29,45.89 R19.2
N$49
  Top 0.254: R14.2 17.46,67.63 16.19,67.63 15.65,66.88 IC5.15
N$50
  Top 0.254: IC5.17 14.36,63.76 14.35,63.75 16.51,63.75 16.51,64.64 16.64,64.77 C18.2
N$51
  Top 0.254: LED1.C 7.62,67.94 10.16,67.94 10.48,67.63 10.48,65.52 IC5.23
N$52
  Top 0.254: LED2.C 9.53,68.58 10.48,68.58 11.11,67.94 IC5.22
N$53
  Top 0.254: R11.1 6.45,70.27 6.67,70.48 6.67,71.22 LED1.A
N$54
  Top 0.254: LED2.A 10.38,72.17 10.48,72.07 10.48,70.48 10.79,70.17 11.64,70.17 R12.1
N$55
  Top 0.254: R16.1 15.24,73.34 15.56,73.66 18.41,73.66 18.08,74.28 X2.D-
N$56
  Top 0.61: U$2.8 R9.2
N$57
  Top 0.254: T5.B 15.88,41.17 R20.2
N$58
  Top 0.254: T6.B 19.37,45.89 R21.2
N$59
  Top 0.254: T7.B 20.96,41.17 R22.2
N$60
  Top 0.254: T8.B 24.45,45.89 R23.2
N$61
  Top 0.254: T9.B 26.04,41.17 R24.2
N$62
  Top 0.254: T10.B 4.13,45.89 R25.2
N$63
  Bottom 0.254: 6.1,38.99 12.45,38.99 | 8.64,42.8 9.91,42.8
  Bottom 0.406: 9.91,42.8 9.91,47.88 8.64,47.88 8.64,42.8 8.64,41.53 arc74 6.1,38.99 6.1,37.72 12.45,37.72 12.45,38.99 arc74 9.91,41.53 9.91,42.8
N$65  (1 unrouted)
  Bottom 0.406: 16.64,44.07 17.91,44.07 | 18.03,42.8 18.03,44.7 17.27,45.47 16.51,44.7 16.51,42.8
N$66
  Bottom 0.406: 15.75,44.2 15.75,42.8 | 15.75,44.2 15.75,45.47 15.37,45.47 arc90 14.48,44.7 arc104 15.75,44.2
N$67
  Bottom 0.406: 13.84,45.34 13.84,43.56 arc-191 12.57,43.56 12.57,45.34
RST  (via drill 0.6)
  Top 0.254: 52.45,32.13 52.45,15.24 53.4,14.29 JP1.5 66.17,18.54 v78.61,18.54 | 52.45,32.13 61.85,32.13 IC4.29 | SV8.6 57.78,48.01 R13.2 54.86,44.71 55.24,44.32 55.24,40.64 52.45,37.97 52.45,32.13 | R8.1 82.47,21.03 S1.4
  Bottom 0.254: v78.61,18.54 79.41,19.34 S1.4
RTS#  (via drill 0.6)
  Top 0.254: JP7.6 45.47,26.67 46.61,26.67 47.88,27.94 47.88,38.35 49.78,40.26 49.78,45.21 | 49.78,45.21 49.78,48.01 R13.1 | IC5.3 8.51,56.52 8.38,56.52 8.38,56.64 4.83,56.64 v3.05,54.86 | v51.18,45.09 51.05,45.21 49.78,45.21
  Bottom 0.254: v3.05,54.86 3.81,54.1 6.48,54.1 7.75,55.37 37.85,55.37 47.62,45.59 47.62,45.47 48.01,45.09 v51.18,45.09
RX  (via drill 0.6)
  Top 0.254: v5.71,55.24 6.35,55.88 9.4,55.88 9.78,56.26 9.78,57.94 IC5.5 | SV3.1 52.96,42.42 48.51,37.97 48.51,27.05 46.86,25.4 44.07,25.4 44.07,22.35 | 44.07,22.35 44.07,22.1 | 44.07,22.35 44.07,21.53 JP7.4 | IC4.30 62.54,30.43 61.47,31.5 54.86,31.5 54.74,31.37 54.36,31.11 53.09,29.84 53.09,24.77 53.34,24.51 v53.34,24
  Bottom 0.254: v5.71,55.24 6.35,55.88 38.42,55.88 47.94,46.35 53.34,46.35 53.98,45.72 SV3.1 | v53.34,24 53.34,23.37 53.09,23.11 48.01,23.11 46.1,21.46 45.21,21.46 JP7.4
SCK  (via drill 0.6)
  Top 0.254: IC6.9 59.27,55.75 62.1,55.75 v62.1,51.82 | IC4.17 71.46,29.08 82.3,29.08 82.93,29.97 82.93,37.97 83.57,38.61 84.96,38.61 85.98,39.62 86.87,39.62 88.33,41.08 SV7.6 88.33,33.34 87.88,32.89 v87.88,21.72
  Bottom 0.254: v62.1,51.82 62.1,45.34 82.93,45.34 84.01,44.39 87.44,44.39 88.27,43.56 88.27,42.48 SV7.6 | JP1.3 67.44,17.27 67.44,17.65 84.45,17.65 87.76,20.95 v87.88,21.72
SND_ENABLE  (via drill 0.38, 0.6)
  Top 0.254: v89.15,21.84 95.05,30.87 | 95.05,30.87 99.95,38.35 99.95,50.16 85.85,50.16 85.47,49.78 SV4.1 | v42.04,14.86 42.04,28.7 42.16,28.83 46.1,28.83 46.99,29.72 v46.99,33.02 | IC4.23 67.44,31.98 v67.44,28.57 | v93.6,31 94.92,31 95.05,30.87
  Bottom 0.254: v42.04,14.86 42.04,12.57 46.74,8.51 69.47,8.51 72.77,11.81 79.5,11.81 81.03,13.46 81.03,16.26 81.28,16.51 84.33,16.51 89.03,21.21 89.03,21.72 v89.15,21.84 | v46.99,33.02 46.48,33.66 S2.2 | v67.44,28.57 70.61,28.57 72.52,30.61 73.03,30.99 73.41,31.37 81.92,31.37 82.17,31.11 82.17,30.99 82.19,31 v93.6,31
TX  (via drill 0.6)
  Top 0.254: 7.21,57.88 IC5.1 6.96,57.72 v4.57,57.72 | JP7.5 46.8,24.07 49.15,26.42 49.15,30.48 v49.4,30.73 49.15,31.24 49.15,37.47 v50.8,38.99 | IC4.31 61.81,29.75 60.58,30.99 58.67,30.99 v58.17,30.35 | v55.88,38.48 55.88,41.91 SV3.2
  Bottom 0.254: SV3.2 56.52,46.23 55.75,46.99 48.26,46.99 38.73,56.52 5.4,56.52 v4.57,57.72 | v55.88,38.48 55.12,37.97 51.82,37.97 v50.8,38.99 | v58.17,30.35 57.91,30.35 57.53,30.73 v49.4,30.73 49.28,30.73
USB_5V  (via drill 0.38, 0.6)
  Top 0.254: v43.18,33.02 43.18,39.37 41.91,40.64 41.91,49.53 43.18,50.8 REG5.5.3 | 12.38,65.09 12.38,65.2 IC5.20 IC5.19 13.05,63.18 | IC5.4 9.21,58.02 9.21,60.96 | v10.22,62.23 13.05,62.2 13.05,63.18 | C18.1 18.1,63.18 13.05,63.18 | 13.02,72.07 12.91,71.97 13.05,71.83 | C17.1 45.59,53.34
  Top 0.406: 9.21,60.96 10.48,62.23 v10.22,62.23
  Top 0.61: 12.91,71.97 R12.2 11.75,73.66 13.55,75.46 13.55,75.49 | v3.49,66.99 3.49,71.75 3.71,71.97 R11.2 5.4,73.66 7.3,75.56 13.47,75.56 13.55,75.49 | 43.34,53.18 v42.23,54.29 | 13.55,75.49 X2.VBUS
  Top 1.016: F1.1 47.94,55.06 47.94,53.34 45.59,53.34 43.18,53.34 43.34,53.18 43.5,53.02 43.44,52.97 REG5.5.3
  Bottom 0.254: v43.18,33.02 43.18,32.13 42.04,30.99 42.04,22.1 43.18,21.08 44.45,19.94 JP7.3 45.34,18.92
  Bottom 0.61: v3.49,66.99 3.43,67.06 7.24,67.06 9.84,62.23 v10.22,62.23 13.14,58.17 17.14,58.1 38.42,58.1 v42.23,54.29
V+  (via drill 0.6)
  Top 0.254: J1.1 45.33,71.19 45.72,70.8 45.72,66.23 45.91,66.17 50.48,59.37 50.48,50.99 50.93,50.55 v63.31,50.61
  Top 1.016: J1.1 28.33,71.19 26.04,68.9 D1.A
  Bottom 0.254: v63.31,50.61 63.88,50.04 70.48,50.04 70.8,49.59 SV8.1
VCC  (via drill 0.6)  (1 unrouted)
  Top 0.254: T10.E 5.08,44.77 | T5.E 17.78,44.77 15.24,44.77 T4.E 15.56,46.21 15.56,54.29 | 20.32,44.77 T6.E | 20.32,44.77 22.86,44.77 T7.E | IC7.8 74.61,66.67 76.84,64.45 R10.2 76.83,62.87 75.88,63.82 70.8,63.82 70.17,63.18 70.17,60.96 72.07,59.05 72.07,51.12 72.39,50.93 | 72.39,50.93 72.71,50.48 74.08,50.48 U$2.1 | 72.39,50.93 64.9,50.93 64.26,48.39 SV8.4 | C10.1 80.01,52.07 83.82,48.26 83.82,46.23 84.58,45.59 92.71,45.59 92.71,43.18 SV7.8 93.47,42.1 93.47,37.47 92.71,36.7 v90.93,36.7 | 40.64,56.52 40.64,40.64 41.91,39.37 41.91,31.75 44.45,31.75 S2.1 | 10.48,54.29 10.48,46.21 T1.E 10.16,44.7 12.57,44.7 12.57,43.67 T3.E | 20.32,44.77 20.64,45.09 20.64,54.29 | T8.E 25.72,45.89 25.72,54.29 | 5.08,44.77 7.62,44.77 T2.E 7.62,43.56 7.62,42.16 7.87,41.91 7.87,38.86 8.64,38.1 8.64,34.29 10.54,32.38 C8.1 | 5.08,44.77 5.08,46.04 5.4,46.04 5.4,54.29 10.48,54.29 | 10.48,54.29 15.56,54.29 | 15.56,54.29 20.64,54.29 | 20.64,54.29 25.72,54.29 | 25.72,54.29 28.96,54.29 | 28.96,54.29 29.53,54.29 30.48,53.34 30.48,51.12 32.38,49.21 37.78,49.21 37.78,50.9 REG3.3.1 | IC3.10 17.59,23.18 v17.65,23.24 | v18.03,16.38 17.21,15.56 IC3.16 15.56,15.34 C13.1 18.42,9.84 32.38,9.84 33.97,7.94 R15.A 37.15,5.71 37.47,5.08 67.44,5.08 67.44,11.3 JP1.2 65.66,13.08 65.66,15.62 67.31,17.27 80.64,17.27 R8.2 | T9.E 28.96,43.67 28.96,54.29 | v10.79,30.86 11.3,30.86 | 11.3,30.86 12.06,30.86 C8.1 | C8.1 | 11.3,30.86 15.37,30.86 15.56,30.67 IC2.10 15.56,30.8 15.62,30.86 15.62,31.75 15.75,31.88 22.23,31.88 23.18,30.92 IC2.16 | 61.34,23.75 60.33,24.77 58.63,24.77 C4.1 58.51,26.33 v57.66,27.18 | 70.77,29.75 69.85,28.83 69.72,28.83 69.34,29.21
  Top 0.254: 69.34,29.21 68.83,29.72 68.83,29.98 IC4.20 72.77,33.91 C14.1 73.41,34.16 v73.41,36.7 | IC4.4 62.97,25.38 61.34,23.75 | 61.34,23.75 62.36,22.73 62.74,22.73 64.23,24.23 IC4.6 64.38,24.25 69.34,29.21
  Top 0.61: 80.01,52.07 79.76,52.32 74.55,52.32 74.3,52.07 U$2.1
  Top 1.016: 45.4,55.24 F1.2 43.81,55.24 42.86,56.2 42.86,56.83 | REG3.3.1 37.56,53.34 37.56,54.07 40.01,56.52 40.64,56.52 42.55,56.52 42.86,56.83 | 42.86,56.83 C5.+
  Bottom 0.254: 17.65,24.26 v17.65,23.24 | 17.65,24.26 17.65,30.35 17.14,30.86 v10.79,30.86 | v18.03,16.38 18.03,17.91 16.64,19.3 16.64,23.88 16.76,24 17.4,24 17.65,24.26 | v57.66,27.18 49.02,27.18 S2.1 | v73.41,36.7 74.42,36.7 74.8,36.32 90.04,36.32 90.68,36.45 v90.93,36.7